# Altium project RasPiHAT-DISPLAY.PrjPcb
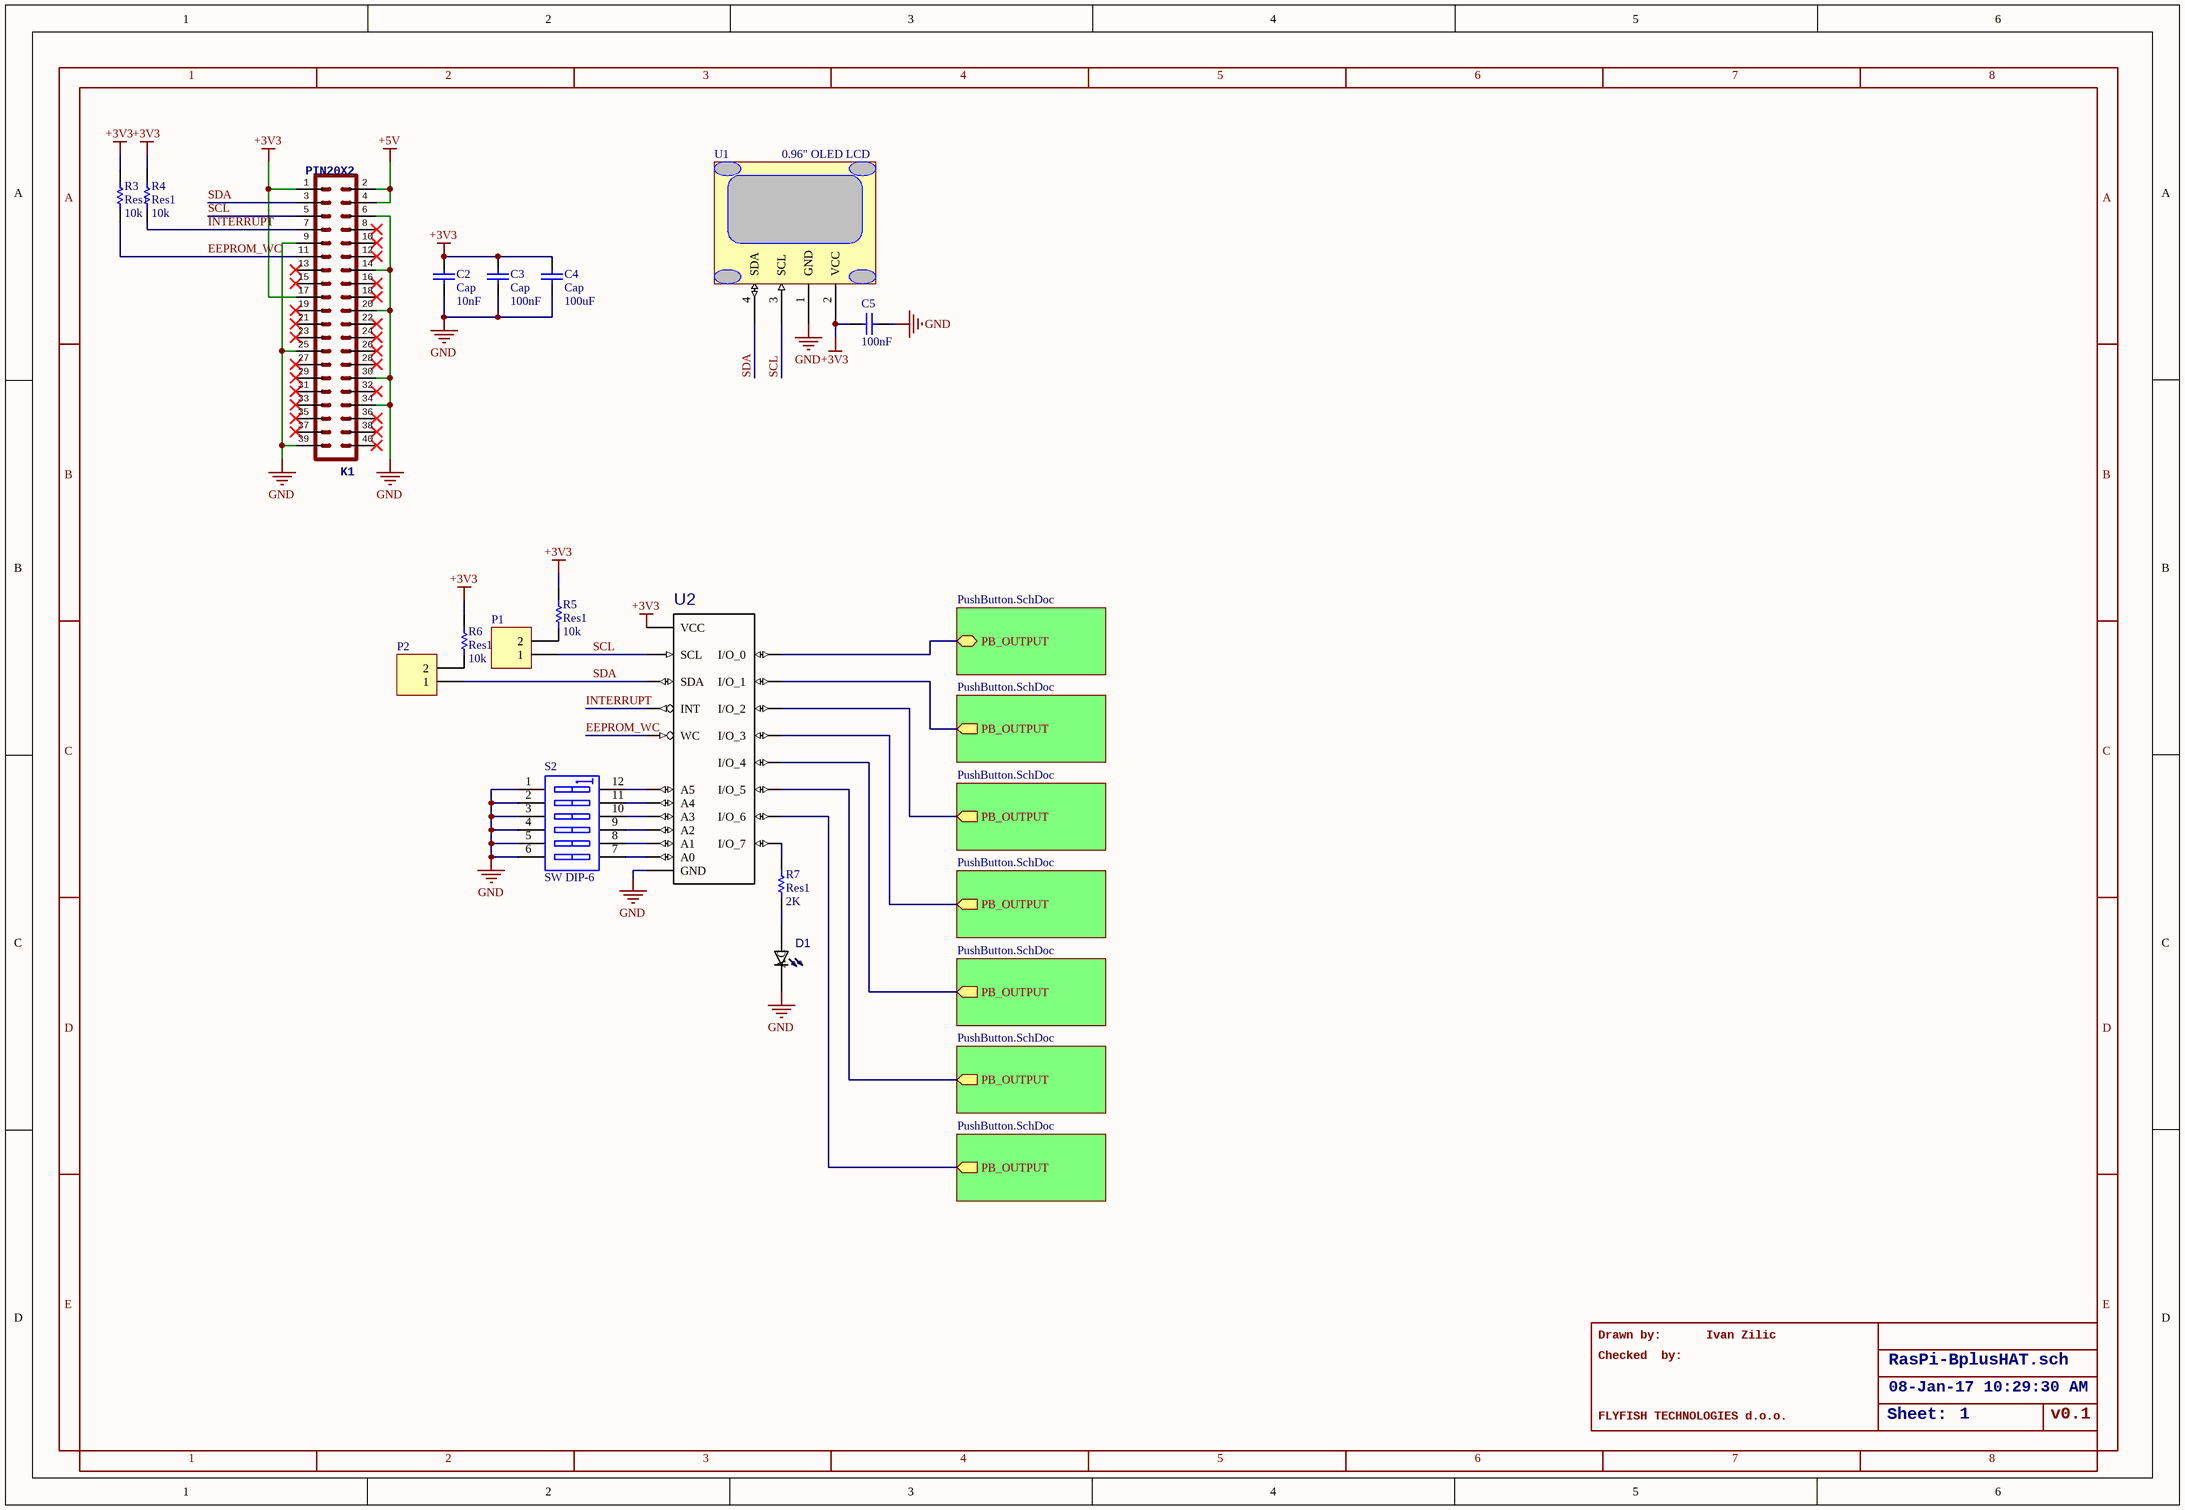
[diagram p0: RasPiHAT-DISPLAY.SchDoc]
2 sheets, 30 parts. Net scope: hierarchical (ports join the sheet entries above them; power ports are global).
Board file: RasPiHAT-DISPLAY.PcbDoc
Sheets:
  RasPiHAT-DISPLAY.SchDoc
    RM = PushButton.SchDoc
    RM = PushButton.SchDoc
    RM = PushButton.SchDoc
    RM = PushButton.SchDoc
    RM = PushButton.SchDoc
    RM = PushButton.SchDoc
    RM = PushButton.SchDoc

## Sheet RasPiHAT-DISPLAY.SchDoc
size 409 x 282 mm; >DRAWING_NAME: RasPi-BplusHAT.sch; >LAST_DATE_TIME: 08-Jan-17 10:29:30 AM; >SHEET: 1; Sheet:: Sheet:

### Parts
C2  Cap  value 10nF  [6-0805_N]
C3  Cap  value 100nF  [6-0805_N]
C4  Cap  value 100uF  [6-0805_N]
C5  value 100nF  [6-0805_N]  (hidden comment: 0805)
D1  0805_LED  [LEDSC200X125X70-2N_598-8160-107F(Primary)]  (value not drawn)
K1  >NAME: K1  [HDR2X20]  (hidden comment: PIN20X2)
P1  Header 2  [HDR1X2]  (value not drawn)
P2  Header 2  [HDR1X2]  (value not drawn)
R3  Res1  value 10k  [6-0805_N]
R4  Res1  value 10k  [6-0805_N]
R5  Res1  value 10k  [6-0805_N]
R6  Res1  value 10k  [6-0805_N]
R7  Res1  value 2K  [6-0805_N]
S2  SW DIP-6  [DIP-12/SW]
U1  0.96" OLED LCD  [0.96 OLED LCD]
U2  PCA9501  [TSSOP20]  (value not drawn)

### Sub-sheets
RM = PushButton.SchDoc: PB_OUTPUT
RM = PushButton.SchDoc: PB_OUTPUT (out)
RM = PushButton.SchDoc: PB_OUTPUT (out)
RM = PushButton.SchDoc: PB_OUTPUT (out)
RM = PushButton.SchDoc: PB_OUTPUT (out)
RM = PushButton.SchDoc: PB_OUTPUT (out)
RM = PushButton.SchDoc: PB_OUTPUT (out)

### Nets
+3V3: C2.2 C3.2 C4.2 C5.1 K1.1 K1.17 R3.1 R4.1 R5.1 R6.1 U1.2(VCC) U2.20(VCC)
+5V: K1.2 K1.4
GND: C2.1 C3.1 C4.1 C5.2 D1.C K1.6 K1.9 K1.14 K1.20 K1.25 K1.30 K1.34 K1.39 S2.1(A1) S2.2(A2) S2.3(A3) S2.4(A4) S2.5(A5) S2.6(A6) U1.1(GND) U2.10(GND)
EEPROM_WC: K1.11 R3.2 U2.17(WC)
INTERRUPT: K1.7 R4.2 U2.8(INT)
SCL: K1.5 P1.1 U1.3(SCL) U2.18(SCL)
SDA: K1.3 P2.1 U1.4(SDA) U2.19(SDA)
NetD1_A: D1.A R7.2
NetP1_2: P1.2 R5.2
NetP2_2: P2.2 R6.2
NetR1_RM1_1: U2.15(I/O_6) ; sheet RM/PB_OUTPUT
NetR1_RM2_1: U2.14(I/O_5) ; sheet RM/PB_OUTPUT
NetR1_RM3_1: U2.13(I/O_4) ; sheet RM/PB_OUTPUT
NetR1_RM4_1: U2.7(I/O_3) ; sheet RM/PB_OUTPUT
NetR1_RM5_1: U2.6(I/O_2) ; sheet RM/PB_OUTPUT
NetR1_RM6_1: U2.5(I/O_1) ; sheet RM/PB_OUTPUT
NetR1_RM7_1: U2.4(I/O_0) ; sheet RM/PB_OUTPUT
NetR7_1: R7.1 U2.16(I/O_7)
NetS2_7: S2.7(B6) U2.1(A0)
NetS2_8: S2.8(B5) U2.2(A1)
NetS2_9: S2.9(B4) U2.3(A2)
NetS2_10: S2.10(B3) U2.12(A3)
NetS2_11: S2.11(B2) U2.11(A4)
NetS2_12: S2.12(B1) U2.9(A5)

Not connected (* = marked no-connect by the designer): K1 8* 10* 12* 13* 15* 16* 18* 19* 21* 22* 23* 24* 26* 27* 28* 29* 31* 32* 33* 35* 36* 37* 38* 40*

### Notes on the sheet
- Drawn by:
- Checked  by:
- Ivan Zilic
- FLYFISH TECHNOLOGIES d.o.o.
- v0.1
- 1
- 2
- 3
- 4
- 5
- 6
- 7
- 8
- A
- B
- C
- D
- E

### Library data of the parts
C2-C4 = Cap: Capacitor; Published: 8-Jun-2000; LatestRevisionDate: 17-Jul-2002; LatestRevisionNote: Re-released for DXP Platform.; PackageReference: RAD-0.3; Publisher: Altium Limited; PackageDescription: Radial Cap, Thru-Hole; 2 Leads; 0.3 in Pin Spacing
C5 = Cap Semi: Capacitor
D1 = 598-8160-107F: LED, SMD; 0805; Yellow-Green; Water Clear Lens; 40mcd; 570/575nm; MF: Dialight; Package: 0805 Dialight; MP: 598-8160-107F; Price: 0.09 USD; Availability: Good; Value: *
P1 P2 = Header 2: Header, 2-Pin; LatestRevisionDate: 17-Jul-2002; LatestRevisionNote: Re-released for DXP Platform.; Publisher: Altium Limited
R3-R7 = Res1: Resistor; Published: 8-Jun-2000; LatestRevisionDate: 17-Jul-2002; LatestRevisionNote: Re-released for DXP Platform.; PackageReference: AXIAL-0.3; Publisher: Altium Limited; PackageDescription: Axial Device, Thru-Hole; 2 Leads; 0.3 in Pin Spacing
S2 = SW DIP-6: DIP Switch, 6 Position, SPST; Published: 24-Mar-1999; LatestRevisionDate: 17-Jul-2002; LatestRevisionNote: Re-released for DXP Platform.; PackageReference: DIP-12/SW; Publisher: Altium Limited; PackageDescription: DIP Switch; 12 Leads
U2 = PCA9501: MF: NXP Semiconductors; MP: PCA9501; Package: None; Availability: Unavailable; Price: None; Value: *
K1 = PIN20X2: >VALUE: PIN20X2

## Sheet PushButton.SchDoc
size A4
Used 7 times, as channels RM, RM, RM, RM, RM, RM, RM. Parts and nets are listed once, with the designators drawn on the sheet.
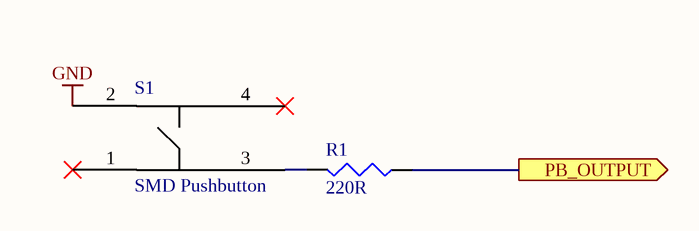
[diagram p1: PushButton.SchDoc]

### Parts
R1  value 220R  [6-0805_N]  (hidden comment: 0805)
S1  SMD Pushbutton  [SMD_PB]

### Ports
PB_OUTPUT (out)

### Nets
GND: S1.2
PB_OUTPUT: R1.1 ; port PB_OUTPUT
NetR1_2: R1.2 S1.3

Not connected (* = marked no-connect by the designer): S1 1* 4*

### Channels
RM: designators end in _RM7; ports PB_OUTPUT=NetR1_RM7_1
RM: designators end in _RM6; ports PB_OUTPUT=NetR1_RM6_1
RM: designators end in _RM5; ports PB_OUTPUT=NetR1_RM5_1
RM: designators end in _RM4; ports PB_OUTPUT=NetR1_RM4_1
RM: designators end in _RM3; ports PB_OUTPUT=NetR1_RM3_1
RM: designators end in _RM2; ports PB_OUTPUT=NetR1_RM2_1
RM: designators end in _RM1; ports PB_OUTPUT=NetR1_RM1_1

### Library data of the parts
R1 = Res3: Resistor, 0.25W
S1 = SMD_PB

## Nets that join several sheets
GND: RasPiHAT-DISPLAY (21 pins), RM (S1_RM7.2), RM (S1_RM6.2), RM (S1_RM5.2), RM (S1_RM4.2), RM (S1_RM3.2), RM (S1_RM2.2), RM (S1_RM1.2)
NetR1_RM1_1: RasPiHAT-DISPLAY (U2.15), RM (R1_RM1.1)
NetR1_RM2_1: RasPiHAT-DISPLAY (U2.14), RM (R1_RM2.1)
NetR1_RM3_1: RasPiHAT-DISPLAY (U2.13), RM (R1_RM3.1)
NetR1_RM4_1: RasPiHAT-DISPLAY (U2.7), RM (R1_RM4.1)
NetR1_RM5_1: RasPiHAT-DISPLAY (U2.6), RM (R1_RM5.1)
NetR1_RM6_1: RasPiHAT-DISPLAY (U2.5), RM (R1_RM6.1)
NetR1_RM7_1: RasPiHAT-DISPLAY (U2.4), RM (R1_RM7.1)